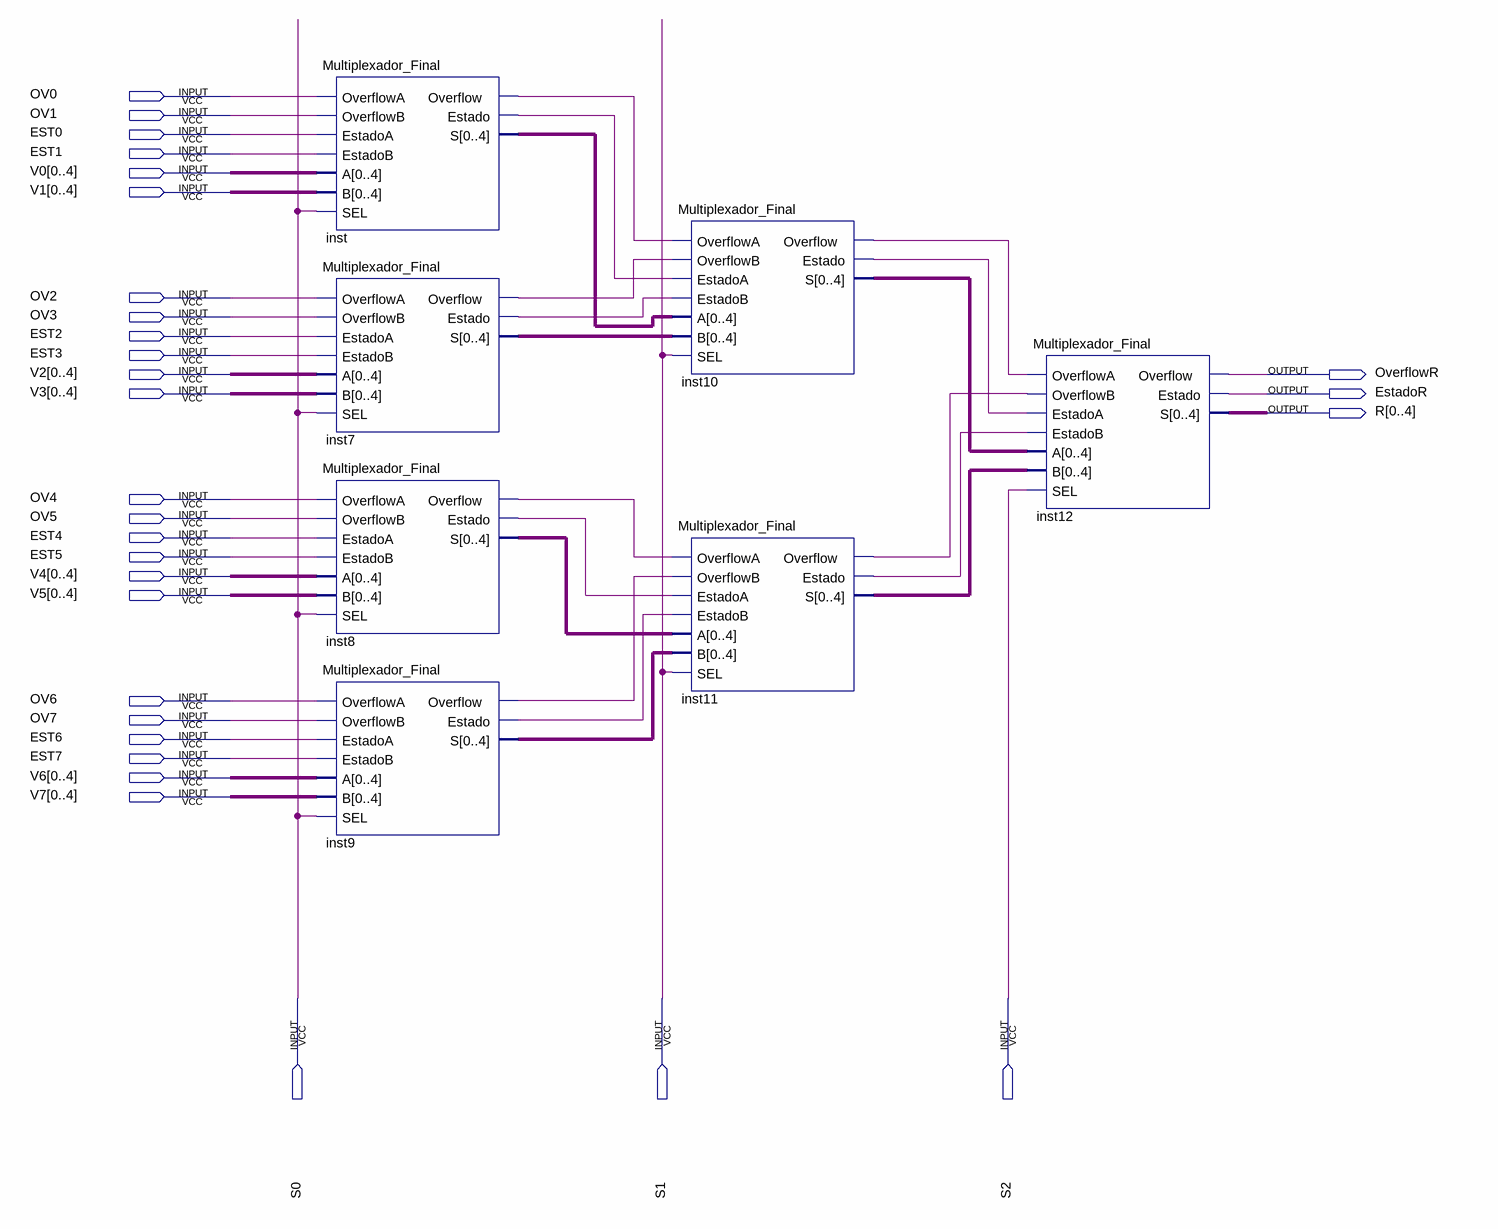
[diagram p0: schematic sheet]
// Quartus schematic Multiplexador_Final_Final.bdf as structural Verilog: 7 symbols, 30 pins
module Multiplexador_Final_Final (
  input  OV0,
  input  OV1,
  input  EST0,
  input  EST1,
  input  [0:4] V0,
  input  [0:4] V1,
  input  OV2,
  input  OV3,
  input  EST2,
  input  EST3,
  input  [0:4] V2,
  input  [0:4] V3,
  input  OV4,
  input  OV5,
  input  EST4,
  input  EST5,
  input  [0:4] V4,
  input  [0:4] V5,
  input  OV6,
  input  OV7,
  input  EST6,
  input  EST7,
  input  [0:4] V6,
  input  [0:4] V7,
  input  S0,
  input  S1,
  input  S2,
  output OverflowR,
  output EstadoR,
  output [0:4] R
);

  wire inst7_estado, inst7_overflow, inst8_estado, inst8_overflow, inst9_estado, inst9_overflow,
       inst10_estado, inst10_overflow, inst11_estado, inst11_overflow, inst_estado, inst_overflow;
  wire [4:0] inst7_s, inst8_s, inst9_s, inst10_s, inst11_s, inst_s;

  Multiplexador_Final inst (
    .OverflowA(OV0), .OverflowB(OV1), .EstadoA(EST0), .EstadoB(EST1), .A(V0), .B(V1), .SEL(S0),
    .Overflow(inst_overflow), .Estado(inst_estado), .S(inst_s));
  Multiplexador_Final inst7 (
    .OverflowA(OV2), .OverflowB(OV3), .EstadoA(EST2), .EstadoB(EST3), .A(V2), .B(V3), .SEL(S0),
    .Overflow(inst7_overflow), .Estado(inst7_estado), .S(inst7_s));
  Multiplexador_Final inst8 (
    .OverflowA(OV4), .OverflowB(OV5), .EstadoA(EST4), .EstadoB(EST5), .A(V4), .B(V5), .SEL(S0),
    .Overflow(inst8_overflow), .Estado(inst8_estado), .S(inst8_s));
  Multiplexador_Final inst9 (
    .OverflowA(OV6), .OverflowB(OV7), .EstadoA(EST6), .EstadoB(EST7), .A(V6), .B(V7), .SEL(S0),
    .Overflow(inst9_overflow), .Estado(inst9_estado), .S(inst9_s));
  Multiplexador_Final inst10 (
    .OverflowA(inst_overflow), .OverflowB(inst7_overflow), .EstadoA(inst_estado), .EstadoB(inst7_estado),
    .A(inst_s), .B(inst7_s), .SEL(S1), .Overflow(inst10_overflow), .Estado(inst10_estado), .S(inst10_s));
  Multiplexador_Final inst11 (
    .OverflowA(inst8_overflow), .OverflowB(inst9_overflow), .EstadoA(inst8_estado), .EstadoB(inst9_estado),
    .A(inst8_s), .B(inst9_s), .SEL(S1), .Overflow(inst11_overflow), .Estado(inst11_estado), .S(inst11_s));
  Multiplexador_Final inst12 (
    .OverflowA(inst10_overflow), .OverflowB(inst11_overflow), .EstadoA(inst10_estado),
    .EstadoB(inst11_estado), .A(inst10_s), .B(inst11_s), .SEL(S2), .Overflow(OverflowR), .Estado(EstadoR),
    .S(R));
endmodule
